# EAGLE design pcb_3 (EAGLE 9.6.2)
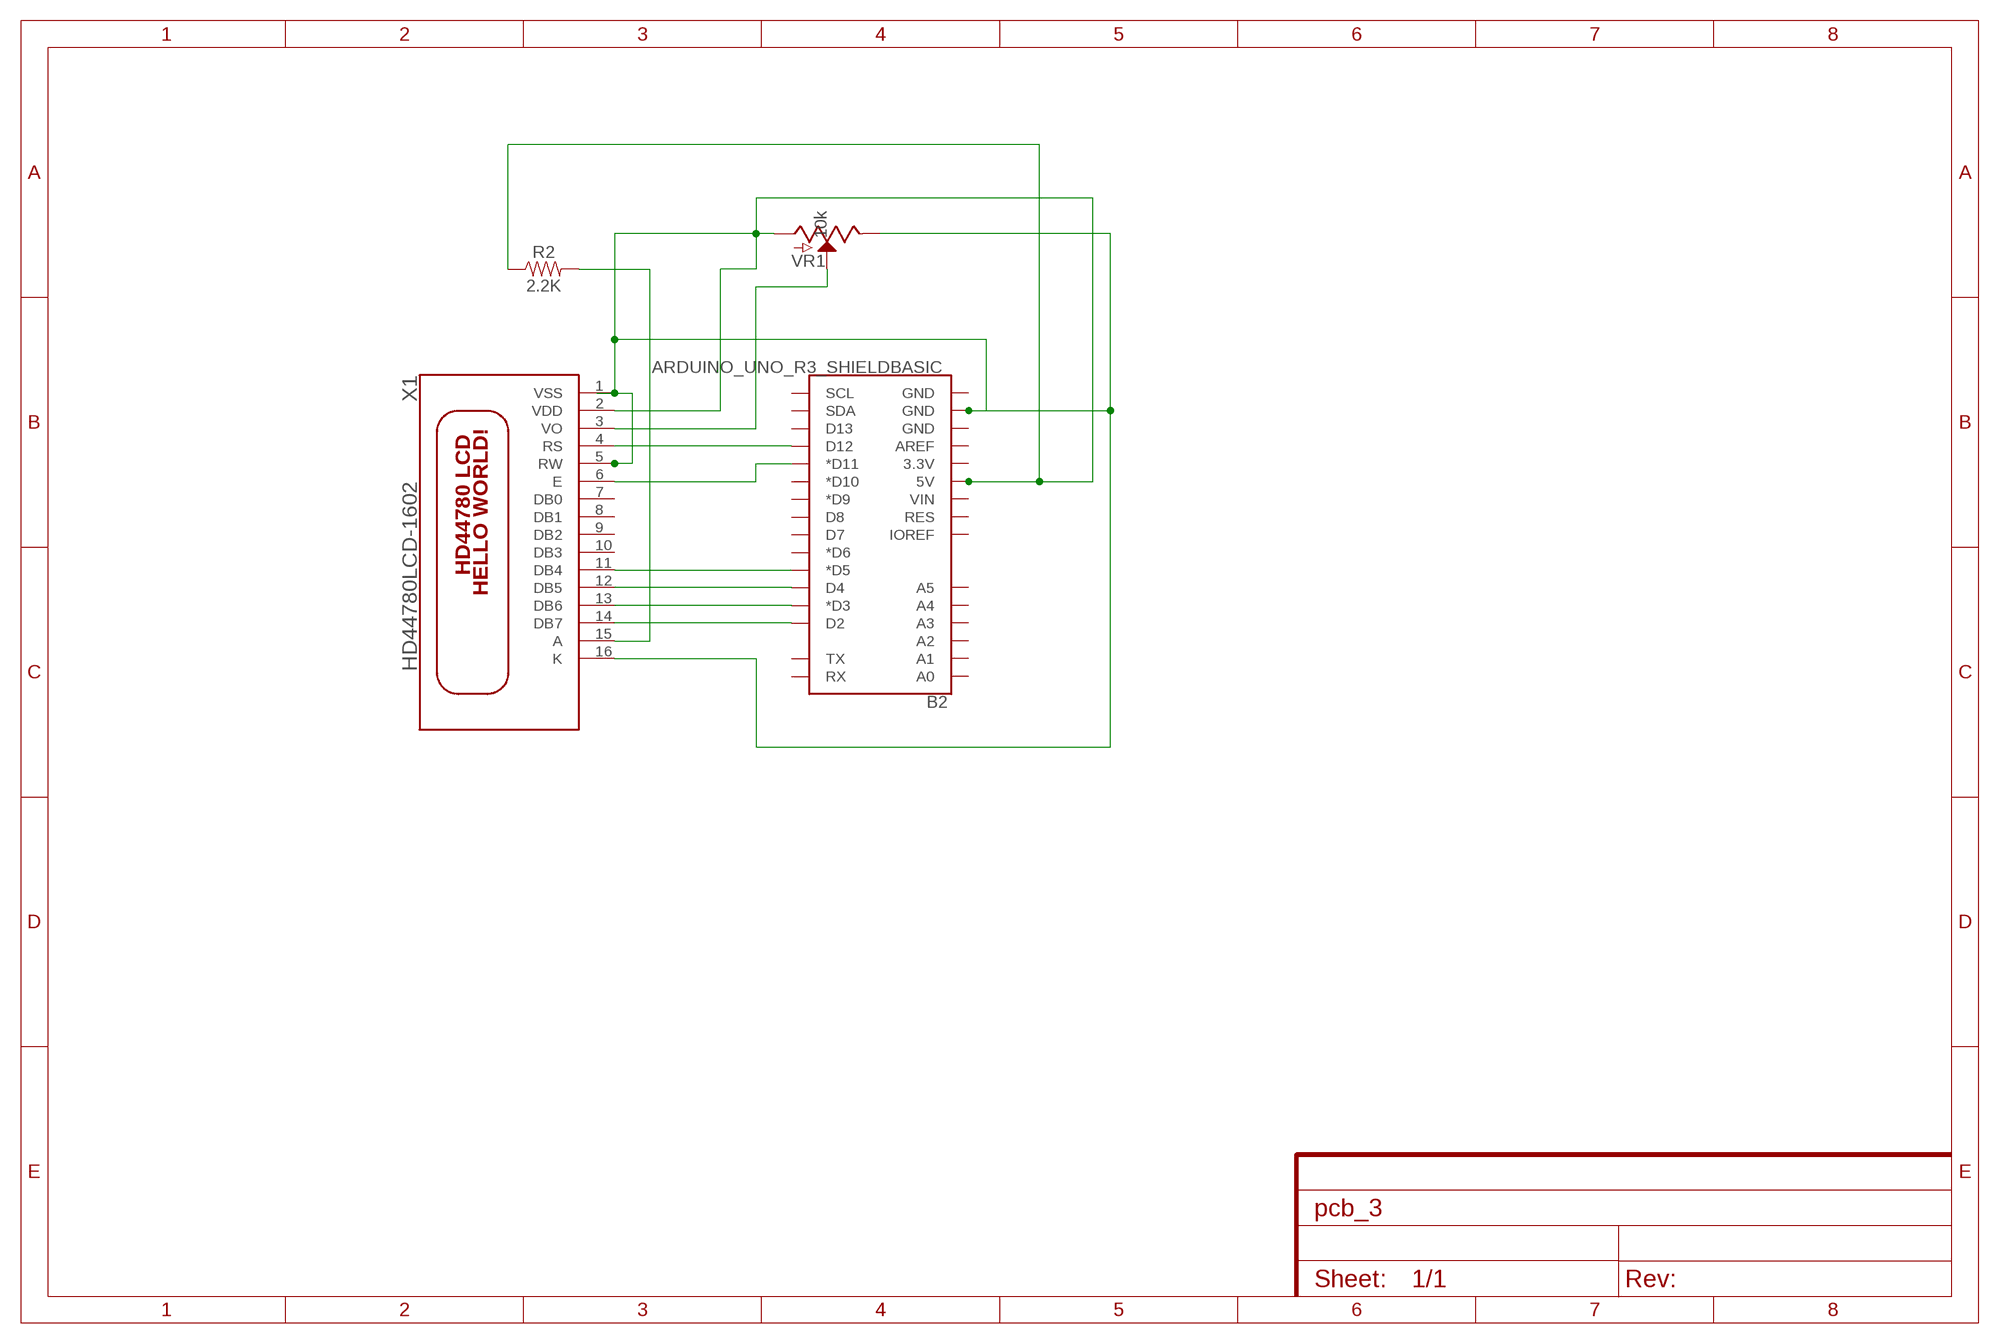
[diagram p0: schematic, sheet 1]

## Parts
B2  ARDUINO_UNO_R3_SHIELDBASIC  [UNO_R3_SHIELD]
R2  2.2K  2.2KOHM-0402-1/16W-1%  [0402]
VR1  10k  POTENTIOMETER-PTH-9MM-1/20W-20%-KIT  [POT-PTH-ALPS-KIT]
X1  HD44780LCD-1602  [LCD1602]

## Nets
N$1: B2.D2 X1.14(DB7)
N$2: B2.D3(*D3) X1.13(DB6)
N$3: B2.D4 X1.12(DB5)
N$4: B2.D11(*D11) X1.6(E)
N$5: B2.D12 X1.4(RS)
N$6: VR1.P$2(S) X1.3(VO)
N$7: B2.D5(*D5) X1.11(DB4)
N$8: R2.2 X1.15(A)
VDD: B2.5V B2.GND@1(GND) R2.1 VR1.P$1(E) VR1.P$3(A) X1.1(VSS) X1.2(VDD) X1.5(RW) X1.16(K)
Unconnected: B2.3.3V B2.A0 B2.A1 B2.A2 B2.A3 B2.A4 B2.A5 B2.AREF B2.D6(*D6) B2.D7 B2.D8 B2.D9(*D9) B2.D10(*D10) B2.D13 B2.GND@0(GND) B2.GND@2(GND) B2.IOREF B2.RES B2.RX B2.SCL B2.SDA B2.TX B2.VIN X1.7(DB0) X1.8(DB1) X1.9(DB2) X1.10(DB3)

## Library data of the parts
B2 = SparkFun-Boards:ARDUINO_UNO_R3_SHIELD: Arduino R3 Shield Footprint Shield form compatible with the Arduino Uno R3. SparkFun Products: MG2639 Cellular Shield <https://www.sparkfun.com/products/13120> MIDI Shield <https://www.sparkfun.com/products/12898> R3 Stackable Headers Kit <https://www.sparkfun.com/products/11417>
R2 = SparkFun-Resistors:2.2KOHM: 2.2kΩ resistor A resistor is a passive two-terminal electrical component that implements electrical resistance as a circuit element. Resistors act to reduce current flow, and, at the same time, act to lower voltage levels within circuits. - Wikipedia; PROD_ID: RES-14341
VR1 = SparkFun-Resistors:POTENTIOMETER: Potentiometer (Pot) Three-terminal potentiometers, with an adjustable wiper and two adjustable resistors. A pot can be used to create a configurable voltage divider, or as a variable resistor. Variants ALPS_POT and ALPS_POT_KIT - PTH, breadboard compatible, 9mm square pots Rotary Potentiometer - Linear (10k ohm) <https://www.sparkfun.com/products/9288> (COM-09288) The KIT variant exposes copper on only one side of the PTH pad, so the part can only be assembled on one side of the PCB. Useful for beginner soldering kits.; PROD_ID: RES-09177; SF_SKU: COM-09288
X1 = adafruit:HD44780LCD: HD44780 LCD Standard character type LCDs, available in sizes from 8x1 to 40x4!

## Board
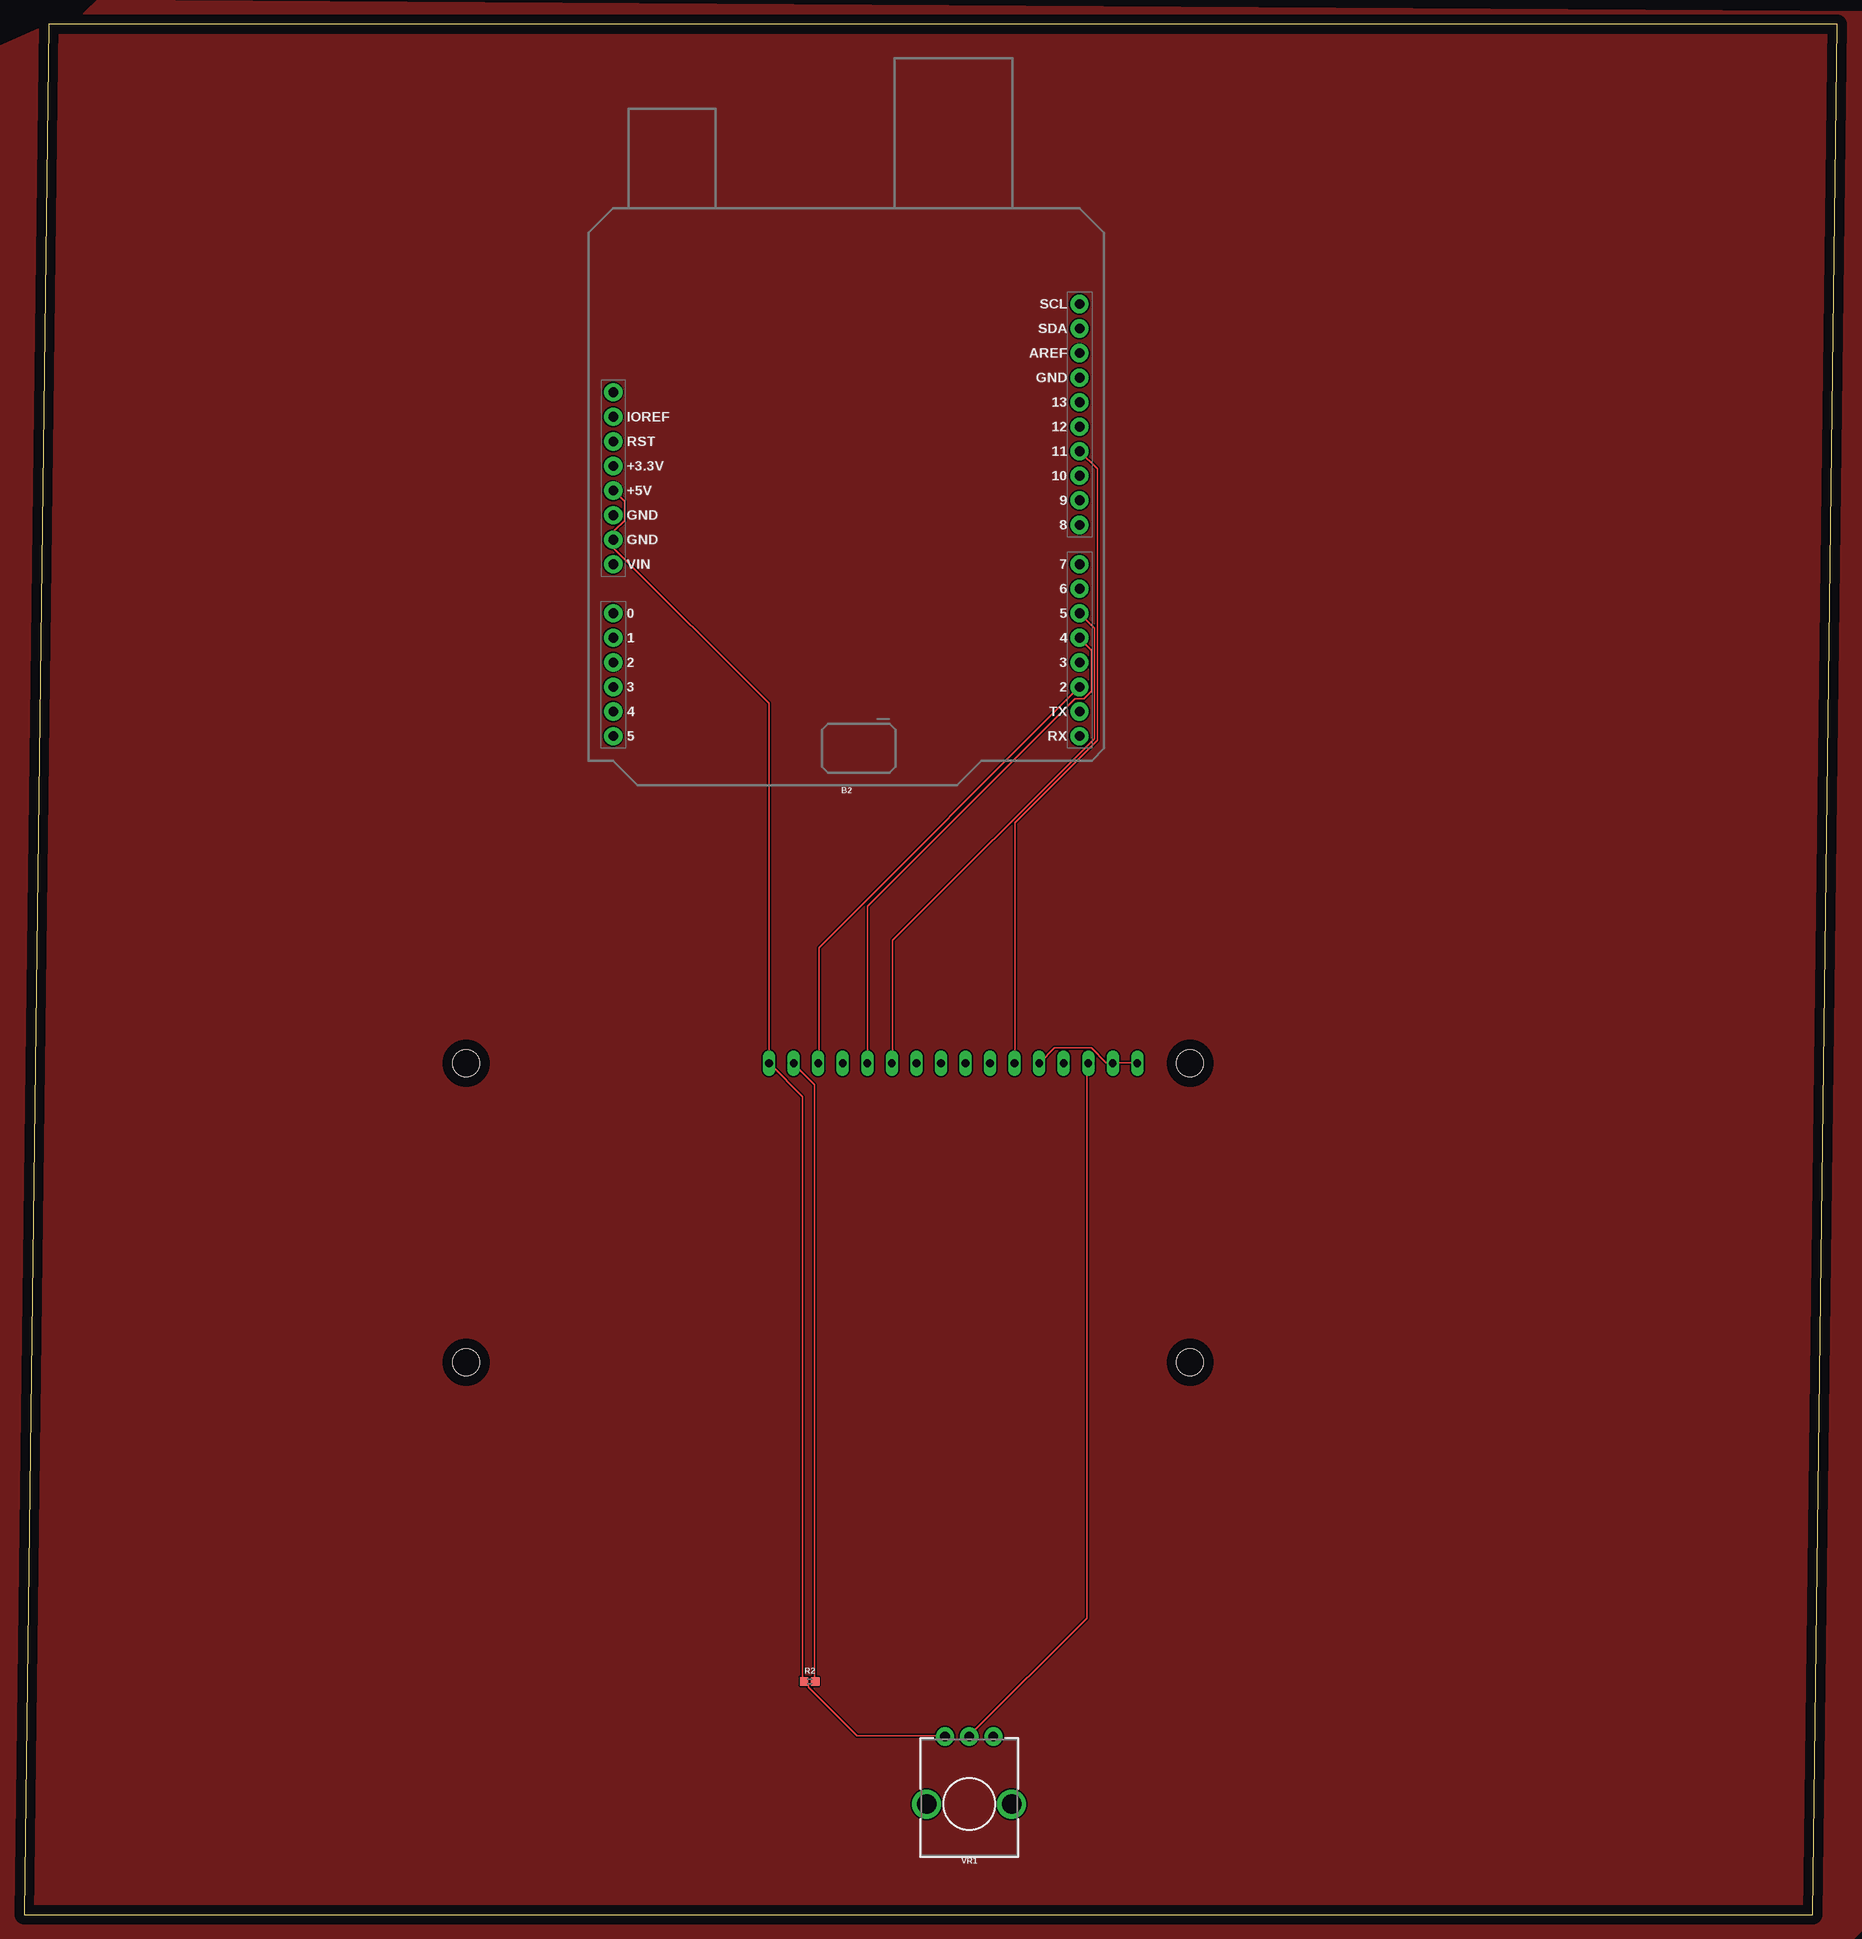
[diagram p1: board, top side]
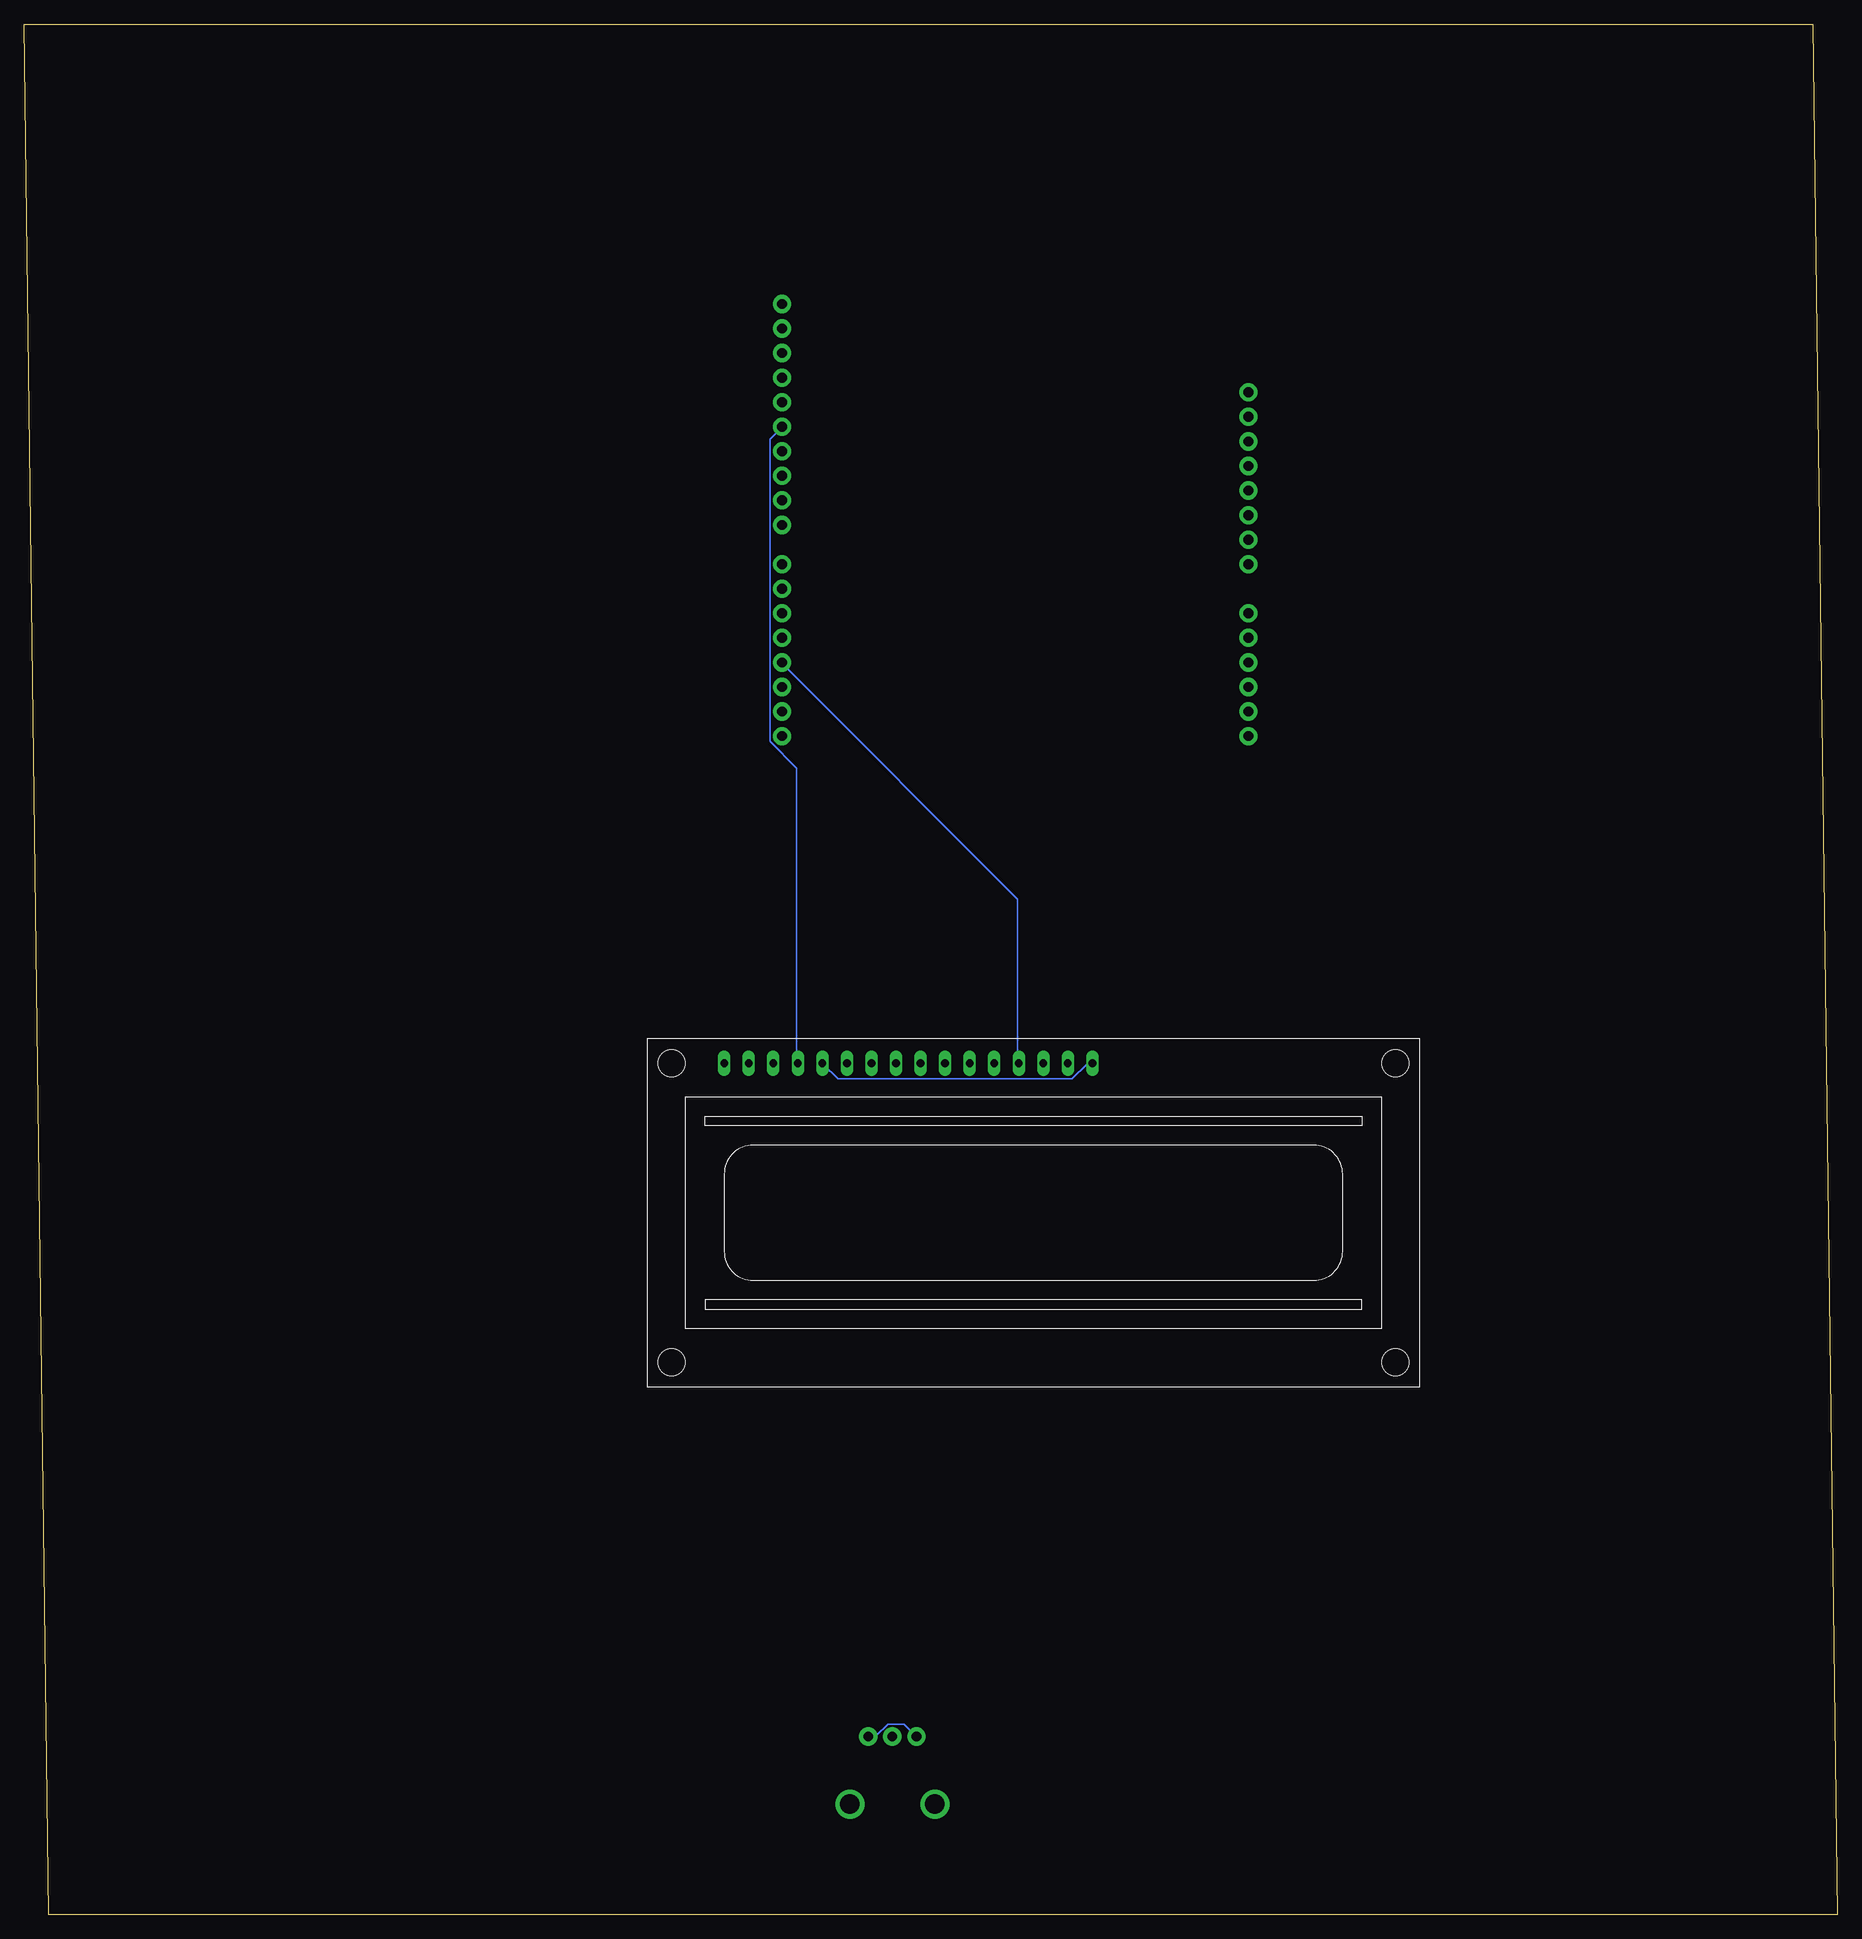
[diagram p2: board, bottom side, seen from below]

Size 187.63 x 195.57 mm. Coordinates in mm from the lower left corner, seen from the top.
Outline: 0,0 185.09,0 187.63,195.57 2.54,195.57 0,0
Copper layers (1*16): Top 0.035mm / dielectric 1.5mm / Bottom 0.035mm
Design rules "default": minimum track width 6mil, minimum drill 0.35mm, track to track 6mil, track to pad 6mil, pad to pad 6mil, via to via 6mil, smd to smd 6mil, copper to edge 40mil, drill to drill 6mil, minimum pad ring 10mil, minimum via ring 8mil, stop-mask expansion 4mil, vias tented up to drill 0mil, thermal gap 10mil

### Footprints (pad centres in the part's own frame; a part is rotated, then mirrored left to right if it is on the bottom)
UNO_R3_SHIELD = drill 1.016 pad 1.88: 3.3V 24.13,-2.54; 5V 24.13,0; A0 24.13,12.7; A1 24.13,15.24; A2 24.13,17.78; A3 24.13,20.32; A4 24.13,22.86; A5 24.13,25.4; AREF -24.13,-14.224; D2 -24.13,20.32; D3 -24.13,17.78; D4 -24.13,15.24; D5 -24.13,12.7; D6 -24.13,10.16; D7 -24.13,7.62; D8 -24.13,3.556; D9 -24.13,1.016; D10 -24.13,-1.524; D11 -24.13,-4.064; D12 -24.13,-6.604; D13 -24.13,-9.144; GND@0 24.13,2.54; GND@1 24.13,5.08; GND@2 -24.13,-11.684; IOREF 24.13,-7.62; NC 24.13,-10.16; RES 24.13,-5.08; RX -24.13,25.4; SCL -24.13,-19.304; SDA -24.13,-16.764; TX -24.13,22.86; VIN 24.13,7.62
0402 = smd 0.85 x 0.9: 1 -0.58,0; 2 0.58,0
POT-PTH-ALPS-KIT = drill 1 pad 1.88: P$1 7,-2.5; P$2 7,0; P$3 7,2.5 | drill 2: P$4 0,-4.4; P$5 0,4.4
LCD1602 = drill 0.8 long: 1 8,33.46; 2 10.54,33.46; 3 13.08,33.46; 4 15.62,33.46; 5 18.16,33.46; 6 20.7,33.46; 7 23.24,33.46; 8 25.78,33.46; 9 28.32,33.46; 10 30.86,33.46; 11 33.4,33.46; 12 35.94,33.46; 13 38.48,33.46; 14 41.02,33.46; 15 43.56,33.46; 16 46.1,33.46 | hole 2.8: 2.54,2.54; 2.54,33.46; 77.46,33.46; 77.46,2.54

### Placement (x,y rotation side)
B2  85.09,147.32 180 top
R2  81.28,24.13 0 top
VR1  97.79,11.43 90 top
X1  123.19,54.61 0 bottom

### Tracks (layer width: path | path; a pad name or v marks a point on that pad's centre or on a via)
GND
  pour Top: 191.77,196.85 191.77,0 185.42,-6.35 -6.35,-6.35 -8.89,-3.81 -8.89,190.5 2.54,195.58 5.08,195.58 6.35,196.85 7.62,198.12
N$1
  Top 0.152: B2.D2 82.24,100.03 82.24,88.14 X1.14
N$2
  Bottom 0.152: X1.13 84.84,88.14 84.84,105.05 109.22,129.44 B2.D3
N$3
  Top 0.152: X1.12 87.27,88.14 87.27,104.29 108.76,125.78 109.68,125.78 110.44,126.54 110.44,130.81 109.22,132.03 B2.D4
N$4
  Top 0.152: B2.D11 111.05,149.56 111.05,121.51 102.51,112.98 102.51,88.14 X1.6
N$5
  Bottom 0.152: X1.4 107.7,88.14 107.7,118.62 110.44,121.36 110.44,152.6 109.22,153.82 B2.D12
N$6
  Top 0.152: X1.3 109.98,87.99 109.98,30.68 97.79,18.49 VR1.P$2
N$7
  Top 0.152: B2.D5 110.74,133.1 110.74,121.67 89.86,100.79 89.86,88.14 X1.11
N$8
  Top 0.152: R2.2 81.79,24.13 81.79,85.85 79.65,87.99 X1.15
VDD
  Top 0.152: VR1.P$3 95.2,18.49 86.21,18.49 81.18,23.52 81.18,23.67 80.72,24.13 R2.1 80.57,24.13 80.57,84.63 77.22,87.99 X1.16 77.06,88.14 77.06,125.32 61.06,141.33 61.06,142.24 | 61.06,142.24 61.06,143.15 62.13,144.22 62.13,146.2 61.06,147.27 B2.5V | X1.1 115.16,88.14 112.72,88.14 X1.2 112.57,88.14 111.96,88.14 110.44,89.66 106.63,89.66 105.1,88.14 X1.5 | 61.06,142.24 B2.GND@1
  Bottom 0.152: VR1.P$1 100.23,18.49 99.47,18.49 98.25,19.71 96.57,19.71 95.35,18.49 VR1.P$3 | X1.16 77.22,87.99 77.67,87.99 79.2,86.46 103.43,86.46 104.95,87.99 X1.5